# Altium schematic sheet Keyboard.SchDoc
size A
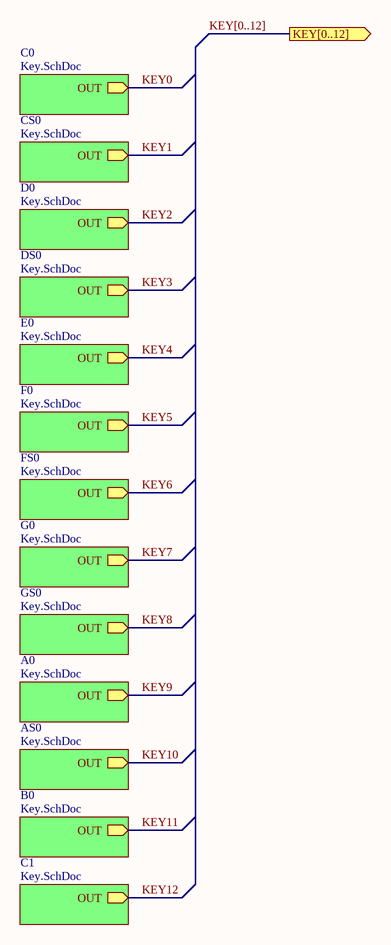
[diagram p0: Keyboard.SchDoc]

## Sub-sheets
A0 = Key.SchDoc: OUT (out)
AS0 = Key.SchDoc: OUT (out)
B0 = Key.SchDoc: OUT (out)
C0 = Key.SchDoc: OUT (out)
C1 = Key.SchDoc: OUT (out)
CS0 = Key.SchDoc: OUT (out)
D0 = Key.SchDoc: OUT (out)
DS0 = Key.SchDoc: OUT (out)
E0 = Key.SchDoc: OUT (out)
F0 = Key.SchDoc: OUT (out)
FS0 = Key.SchDoc: OUT (out)
G0 = Key.SchDoc: OUT (out)
GS0 = Key.SchDoc: OUT (out)

## Ports
KEY[0..12] (out)

## Nets
KEY0: sheet C0/OUT
KEY1: sheet CS0/OUT
KEY2: sheet D0/OUT
KEY3: sheet DS0/OUT
KEY4: sheet E0/OUT
KEY5: sheet F0/OUT
KEY6: sheet FS0/OUT
KEY7: sheet G0/OUT
KEY8: sheet GS0/OUT
KEY9: sheet A0/OUT
KEY10: sheet AS0/OUT
KEY11: sheet B0/OUT
KEY12: sheet C1/OUT

## Buses and harness runs
bus KEY[0..12] = port KEY[0..12]